# Altium schematic sheet Input connector 12ch.SchDoc
size A4
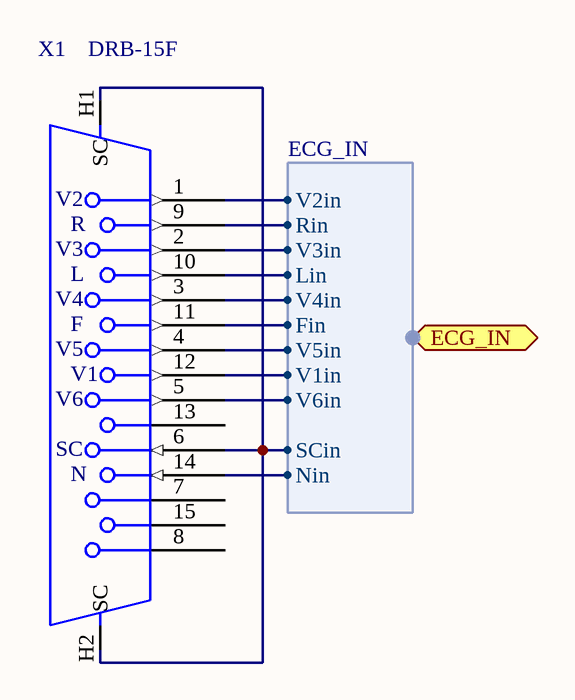
[diagram p0: Input connector 12ch.SchDoc]

## Parts
X1  DRB-15F  [DRB-15F]

## Ports
ECG_IN (harness ECG_IN)

## Harnesses
ECG_IN: Rin, Lin, Fin, V1in, V2in, V3in, V4in, V5in, V6in, SCin, Nin

## Nets
NetX1_1: X1.1 ; port ECG_IN.V2in
NetX1_2: X1.2 ; port ECG_IN.V3in
NetX1_3: X1.3 ; port ECG_IN.V4in
NetX1_4: X1.4 ; port ECG_IN.V5in
NetX1_5: X1.5 ; port ECG_IN.V6in
NetX1_6: X1.6 X1.H1(SC) X1.H2(SC) ; port ECG_IN.SCin
NetX1_9: X1.9 ; port ECG_IN.Rin
NetX1_10: X1.10 ; port ECG_IN.Lin
NetX1_11: X1.11 ; port ECG_IN.Fin
NetX1_12: X1.12 ; port ECG_IN.V1in
NetX1_14: X1.14 ; port ECG_IN.Nin

Not connected (* = marked no-connect by the designer): X1 7 8 13 15

## Notes on the sheet
- (in symbol ECG Cable DRB-15F) V2; R; V3; L; V4; F; V5; V1; V6; N

## Library data of the parts
X1 = ECG Cable DRB-15F: Value: DRB-15F